# Altium project TTN_Gateway_V2.3.1.PrjPcb (part 1 of 2)
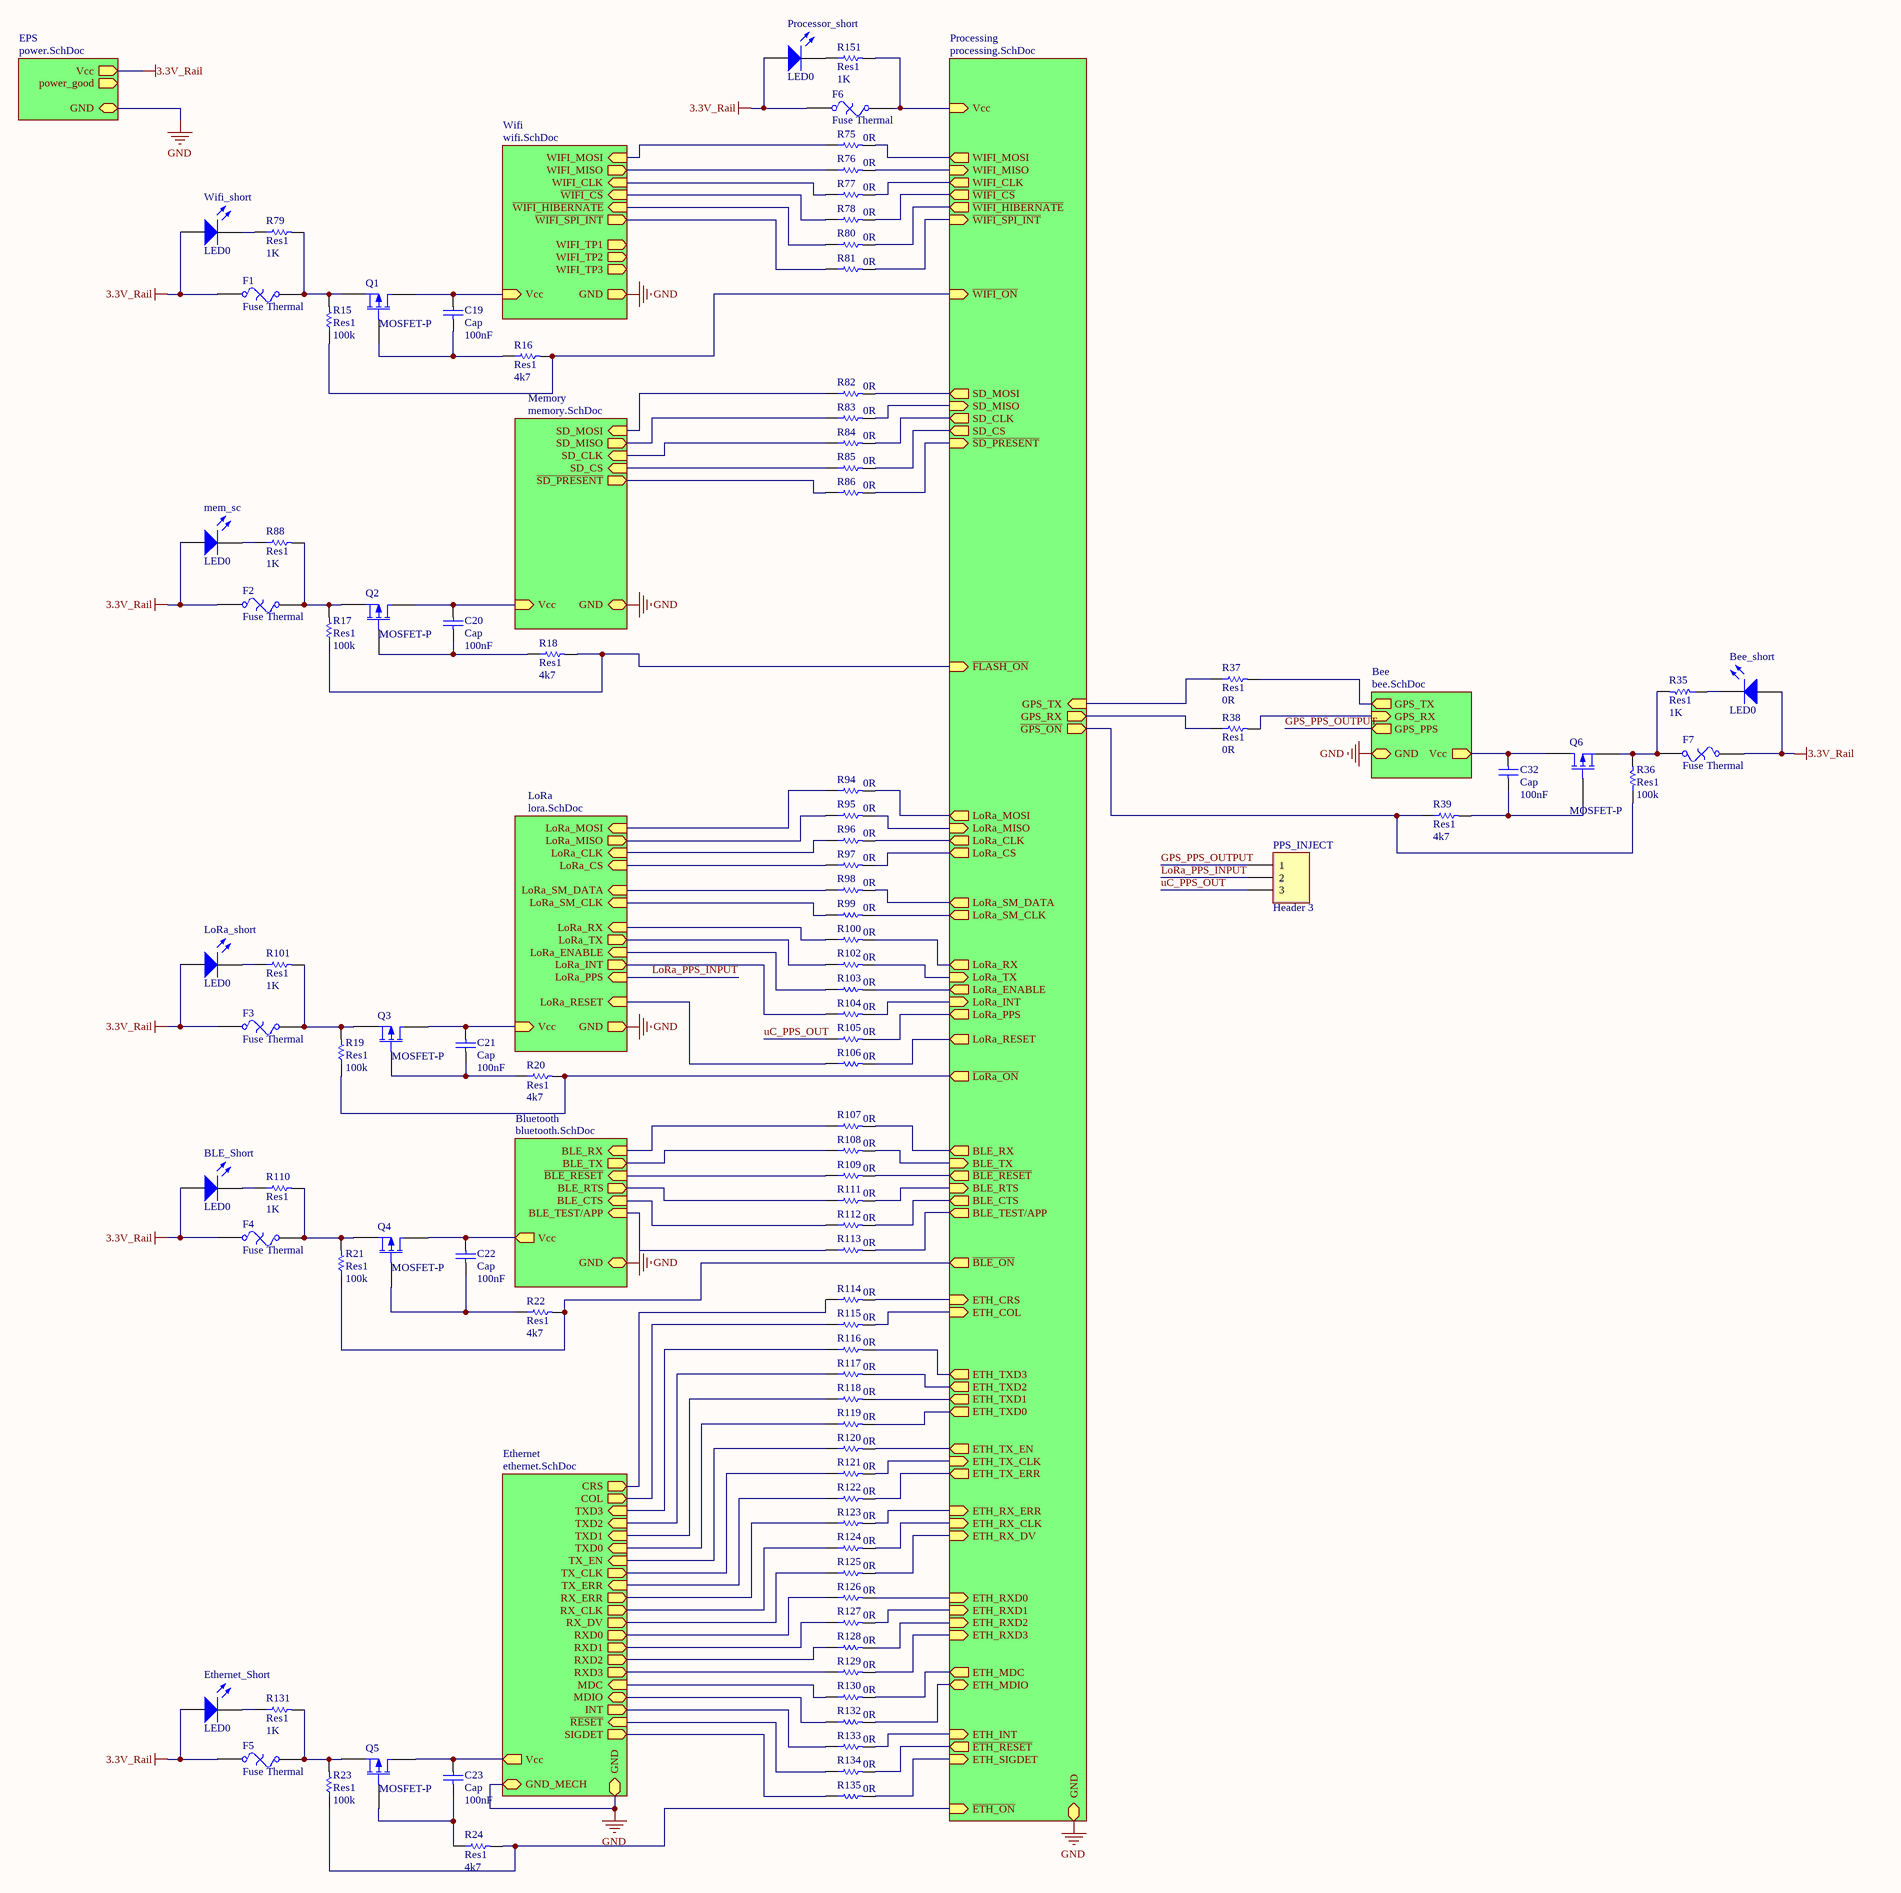
[diagram p0: toplevel.SchDoc]
TWTG_ProjectName: The Things Gateway
9 sheets, 331 parts. Net scope: hierarchical (ports join the sheet entries above them; power ports are global).
Board file: TTN_Gateway_V2.3.1.PcbDoc
Sheets:
  toplevel.SchDoc
    EPS = power.SchDoc
    Wifi = wifi.SchDoc
    Memory = memory.SchDoc
    Ethernet = ethernet.SchDoc
    LoRa = lora.SchDoc
    Bluetooth = bluetooth.SchDoc
    Processing = processing.SchDoc
    Bee = bee.SchDoc

## Sheet toplevel.SchDoc: The Things Gateway Toplevel Overview
size A2; DocumentNumber: 1; SheetNumber: 1; SheetTotal: 9

### Parts
Bee_short  LED0  [C0603]
BLE_Short  LED0  [C0603]
C19  Cap  value 100nF  [6-0805_L]
C20  Cap  value 100nF  [6-0805_L]
C21  Cap  value 100nF  [6-0805_L]
C22  Cap  value 100nF  [6-0805_L]
C23  Cap  value 100nF  [6-0805_L]
C32  Cap  value 100nF  [6-0805_L]
Ethernet_Short  LED0  [C0603]
F1  Fuse Thermal  [1812-polyfuse]
F2  Fuse Thermal  [1812-polyfuse]
F3  Fuse Thermal  [1812-polyfuse]
F4  Fuse Thermal  [1812-polyfuse]
F5  Fuse Thermal  [1812-polyfuse]
F6  Fuse Thermal  [1812-polyfuse]
F7  Fuse Thermal  [1812-polyfuse]
LoRa_short  LED0  [C0603]
mem_sc  LED0  [C0603]
PPS_INJECT  Header 3  [HDR1X3]
Processor_short  LED0  [C0603]
Q1  MOSFET-P  [SOT23_N]
Q2  MOSFET-P  [SOT23_N]
Q3  MOSFET-P  [SOT23_N]
Q4  MOSFET-P  [SOT23_N]
Q5  MOSFET-P  [SOT23_N]
Q6  MOSFET-P  [SOT23_N]
R15  Res1  value 100k  [R0603]
R16  Res1  value 4k7  [R0603]
R17  Res1  value 100k  [R0603]
R18  Res1  value 4k7  [R0603]
R19  Res1  value 100k  [R0603]
R20  Res1  value 4k7  [R0603]
R21  Res1  value 100k  [R0603]
R22  Res1  value 4k7  [R0603]
R23  Res1  value 100k  [R0603]
R24  Res1  value 4k7  [R0603]
R35  Res1  value 1K  [R0603]
R36  Res1  value 100k  [R0603]
R37  Res1  value 0R  [R0603]
R38  Res1  value 0R  [R0603]
R39  Res1  value 4k7  [R0603]
R75  value 0R  [R0603]
R76  value 0R  [R0603]
R77  value 0R  [R0603]
R78  value 0R  [R0603]
R79  Res1  value 1K  [R0603]
R80  value 0R  [R0603]
R81  value 0R  [R0603]
R82  value 0R  [R0603]
R83  value 0R  [R0603]
R84  value 0R  [R0603]
R85  value 0R  [R0603]
R86  value 0R  [R0603]
R88  Res1  value 1K  [R0603]
R94  value 0R  [R0603]
R95  value 0R  [R0603]
R96  value 0R  [R0603]
R97  value 0R  [R0603]
R98  value 0R  [R0603]
R99  value 0R  [R0603]
R100  value 0R  [R0603]
R101  Res1  value 1K  [R0603]
R102  value 0R  [R0603]
R103  value 0R  [R0603]
R104  value 0R  [R0603]
R105  value 0R  [R0603]
R106  value 0R  [R0603]
R107  value 0R  [R0603]
R108  value 0R  [R0603]
R109  value 0R  [R0603]
R110  Res1  value 1K  [R0603]
R111  value 0R  [R0603]
R112  value 0R  [R0603]
R113  value 0R  [R0603]
R114  value 0R  [R0603]
R115  value 0R  [R0603]
R116  value 0R  [R0603]
R117  value 0R  [R0603]
R118  value 0R  [R0603]
R119  value 0R  [R0603]
R120  value 0R  [R0603]
R121  value 0R  [R0603]
R122  value 0R  [R0603]
R123  value 0R  [R0603]
R124  value 0R  [R0603]
R125  value 0R  [R0603]
R126  value 0R  [R0603]
R127  value 0R  [R0603]
R128  value 0R  [R0603]
R129  value 0R  [R0603]
R130  value 0R  [R0603]
R131  Res1  value 1K  [R0603]
R132  value 0R  [R0603]
R133  value 0R  [R0603]
R134  value 0R  [R0603]
R135  value 0R  [R0603]
R151  Res1  value 1K  [R0603]
Wifi_short  LED0  [C0603]

### Sub-sheets
Bee = bee.SchDoc: Vcc (out), GND, GPS_TX (out), GPS_RX (in), GPS_PPS (out)
Bluetooth = bluetooth.SchDoc: Vcc (out), GND (bidir), BLE_RX (in), BLE_TX (out), ~{BLE_RESET} (in), BLE_RTS (out), BLE_CTS (in), BLE_TEST/APP (in)
EPS = power.SchDoc: Vcc (out), GND (bidir), power_good (out)
Ethernet = ethernet.SchDoc: CRS (out), COL (out), TXD3 (in), TXD2 (in), TXD1 (in), TXD0 (in), TX_EN (in), TX_CLK (out), TX_ERR (in), RX_ERR (out), RX_CLK (out), RX_DV (out), RXD0 (out), RXD1 (out), RXD2 (out), RXD3 (out), MDC (in), MDIO, INT (out), ~{RESET} (in), SIGDET (out), Vcc (out), GND (bidir), GND_MECH (bidir)
LoRa = lora.SchDoc: LoRa_MOSI (in), LoRa_MISO (out), LoRa_CLK (in), LoRa_CS (in), LoRa_RX (in), LoRa_TX (out), LoRa_INT (out), LoRa_PPS (in), LoRa_ENABLE (in), LoRa_RESET (in), Vcc (in), GND (out), LoRa_SM_DATA (in), LoRa_SM_CLK (in)
Memory = memory.SchDoc: SD_MOSI (in), SD_MISO (out), SD_CLK (in), SD_CS (in), Vcc (in), GND, ~{SD_PRESENT} (out)
Processing = processing.SchDoc: WIFI_MOSI (out), WIFI_MISO (in), WIFI_CLK (out), ~{WIFI_CS} (out), ~{WIFI_SPI_INT} (in), ~{WIFI_HIBERNATE} (out), SD_MOSI (out), SD_MISO (in), SD_CLK (out), SD_CS (out), ~{SD_PRESENT} (in), LoRa_MOSI (out), LoRa_MISO (in), LoRa_CLK (out), LoRa_CS (out), LoRa_SM_DATA (out), LoRa_SM_CLK (out), LoRa_RX (out), LoRa_TX (in), LoRa_INT (in), LoRa_PPS (out), LoRa_ENABLE (out), LoRa_RESET (out), BLE_RX (out), BLE_TX (in), ~{BLE_RESET} (out), BLE_RTS (in), BLE_CTS (out), BLE_TEST/APP (out), ETH_CRS (in), ETH_COL (in), ETH_TXD3 (out), ETH_TXD2 (out), ETH_TXD1 (out), ETH_TXD0 (out), ETH_TX_EN (out), ETH_TX_CLK (in), ETH_TX_ERR (out), ETH_RX_ERR (in), ETH_RX_CLK (in), ETH_RX_DV (in), ETH_RXD0 (in), ETH_RXD1 (in), ETH_RXD2 (in), ETH_RXD3 (in), ETH_MDC (out), ETH_MDIO, ETH_INT (in), ~{ETH_RESET} (out), ETH_SIGDET (in), Vcc (in), GND (bidir), ~{WIFI_ON} (in), ~{FLASH_ON} (in), ~{LoRa_ON} (out), ~{BLE_ON} (out), ~{ETH_ON} (in), GPS_TX (in), ~{GPS_ON} (out), GPS_RX (out)
Wifi = wifi.SchDoc: Vcc (in), GND (out), WIFI_MOSI (in), WIFI_MISO (out), WIFI_CLK (in), ~{WIFI_CS} (in), WIFI_TP1 (out), WIFI_TP2 (out), WIFI_TP3 (out), ~{WIFI_HIBERNATE} (in), ~{WIFI_SPI_INT} (out)

### Nets
3.3V_Rail: Bee_short.1(A) BLE_Short.1(A) Ethernet_Short.1(A) F1.1 F2.1 F3.1 F4.1 F5.1 F6.1 F7.1 LoRa_short.1(A) mem_sc.1(A) Processor_short.1(A) Wifi_short.1(A) ; sheet EPS/Vcc
ETH_VCC: C23.2 Q5.1(D) ; sheet Ethernet/Vcc
GND: sheet EPS/GND, sheet Wifi/GND, sheet Memory/GND, sheet Ethernet/GND, sheet Ethernet/GND_MECH, sheet LoRa/GND, sheet Bluetooth/GND, sheet Processing/GND, sheet Bee/GND
PROCESSOR_VCC: F6.2 R151.2 ; sheet Processing/Vcc
BLE_CTS: R112.1 ; sheet Bluetooth/BLE_CTS
BLE_RTS: R111.1 ; sheet Bluetooth/BLE_RTS
BLE_RX: R107.1 ; sheet Bluetooth/BLE_RX
BLE_TX: R108.1 ; sheet Bluetooth/BLE_TX
BLE_VCC: C22.2 Q4.1(D) ; sheet Bluetooth/Vcc
GPS_PPS_OUTPUT: PPS_INJECT.1 ; sheet Bee/GPS_PPS
LoRa_PPS_INPUT: PPS_INJECT.2 ; sheet LoRa/LoRa_PPS
MEMORY_VCC: C20.2 Q2.1(D) ; sheet Memory/Vcc
uC_PPS_OUT: PPS_INJECT.3 R105.1
WIFI_VCC: C19.2 Q1.1(D) ; sheet Wifi/Vcc
NetBee_1: C32.2 Q6.1(D) ; sheet Bee/Vcc
NetBee_2: R37.2 ; sheet Bee/GPS_TX
NetBee_3: R38.2 ; sheet Bee/GPS_RX
NetBee_short_2: Bee_short.2(K) R35.1
NetBLE_Short_2: BLE_Short.2(K) R110.1
NetC19_1: C19.1 Q1.2(G) R16.1
NetC20_1: C20.1 Q2.2(G) R18.1
NetC21_1: C21.1 Q3.2(G) R20.1
NetC21_2: C21.2 Q3.1(D) ; sheet LoRa/Vcc
NetC22_1: C22.1 Q4.2(G) R22.1
NetC23_1: C23.1 Q5.2(G) R24.1
NetC32_1: C32.1 Q6.2(G) R39.2
NetD16_3: R134.1 ; sheet Ethernet/~{RESET}
NetEthernet_Short_2: Ethernet_Short.2(K) R131.1
NetF1_2: F1.2 Q1.3(S) R15.2 R79.2
NetF2_2: F2.2 Q2.3(S) R17.2 R88.2
NetF3_2: F3.2 Q3.3(S) R19.2 R101.2
NetF4_2: F4.2 Q4.3(S) R21.2 R110.2
NetF5_2: F5.2 Q5.3(S) R23.2 R131.2
NetF7_2: F7.2 Q6.3(S) R35.2 R36.2
NetLoRa_short_2: LoRa_short.2(K) R101.1
Netmem_sc_2: mem_sc.2(K) R88.1
NetProcessor_short_2: Processor_short.2(K) R151.1
NetR9_1: R78.1 ; sheet Wifi/~{WIFI_CS}
NetR10_1: R80.1 ; sheet Wifi/~{WIFI_HIBERNATE}
NetR11_2: R76.1 ; sheet Wifi/WIFI_MISO
NetR14_2: R86.1 ; sheet Memory/~{SD_PRESENT}
NetR15_1: R15.1 R16.2 ; sheet Processing/~{WIFI_ON}
NetR17_1: R17.1 R18.2 ; sheet Processing/~{FLASH_ON}
NetR19_1: R19.1 R20.2 ; sheet Processing/~{LoRa_ON}
NetR21_1: R21.1 R22.2 ; sheet Processing/~{BLE_ON}
NetR23_1: R23.1 R24.2 ; sheet Processing/~{ETH_ON}
NetR36_1: R36.1 R39.1 ; sheet Processing/~{GPS_ON}
NetR37_1: R37.1 ; sheet Processing/GPS_TX
NetR38_1: R38.1 ; sheet Processing/GPS_RX
NetR40_1: R109.1 ; sheet Bluetooth/~{BLE_RESET}
NetR41_1: R85.1 ; sheet Memory/SD_CS
NetR43_1: R97.1 ; sheet LoRa/LoRa_CS
NetR48_2: R102.1 ; sheet LoRa/LoRa_TX
NetR50_2: R100.1 ; sheet LoRa/LoRa_RX
NetR51_2: R99.2 ; sheet Processing/LoRa_SM_CLK
NetR52_2: R98.2 ; sheet Processing/LoRa_SM_DATA
NetR55_2: R114.1 ; sheet Ethernet/CRS
NetR56_2: R122.1 ; sheet Ethernet/TX_ERR
NetR71_1: R113.1 ; sheet Bluetooth/BLE_TEST/APP
NetR75_1: R75.1 ; sheet Wifi/WIFI_MOSI
NetR75_2: R75.2 ; sheet Processing/WIFI_MOSI
NetR76_2: R76.2 ; sheet Processing/WIFI_MISO
NetR77_1: R77.1 ; sheet Wifi/WIFI_CLK
NetR77_2: R77.2 ; sheet Processing/WIFI_CLK
NetR78_2: R78.2 ; sheet Processing/~{WIFI_CS}
NetR79_1: R79.1 Wifi_short.2(K)
NetR80_2: R80.2 ; sheet Processing/~{WIFI_HIBERNATE}
NetR81_1: R81.1 ; sheet Wifi/~{WIFI_SPI_INT}
NetR81_2: R81.2 ; sheet Processing/~{WIFI_SPI_INT}
NetR82_1: R82.1 ; sheet Memory/SD_MOSI
NetR82_2: R82.2 ; sheet Processing/SD_MOSI
NetR83_1: R83.1 ; sheet Memory/SD_MISO
NetR83_2: R83.2 ; sheet Processing/SD_MISO
NetR84_1: R84.1 ; sheet Memory/SD_CLK
NetR84_2: R84.2 ; sheet Processing/SD_CLK
NetR85_2: R85.2 ; sheet Processing/SD_CS
NetR86_2: R86.2 ; sheet Processing/~{SD_PRESENT}
NetR94_1: R94.1 ; sheet LoRa/LoRa_MOSI
NetR94_2: R94.2 ; sheet Processing/LoRa_MOSI
NetR95_1: R95.1 ; sheet LoRa/LoRa_MISO
NetR95_2: R95.2 ; sheet Processing/LoRa_MISO
NetR96_1: R96.1 ; sheet LoRa/LoRa_CLK
NetR96_2: R96.2 ; sheet Processing/LoRa_CLK
NetR97_2: R97.2 ; sheet Processing/LoRa_CS
NetR98_1: R98.1 ; sheet LoRa/LoRa_SM_DATA
NetR99_1: R99.1 ; sheet LoRa/LoRa_SM_CLK
NetR100_2: R100.2 ; sheet Processing/LoRa_RX
NetR102_2: R102.2 ; sheet Processing/LoRa_TX
NetR103_1: R103.1 ; sheet LoRa/LoRa_ENABLE
NetR103_2: R103.2 ; sheet Processing/LoRa_ENABLE
NetR104_1: R104.1 ; sheet LoRa/LoRa_INT
NetR104_2: R104.2 ; sheet Processing/LoRa_INT
NetR105_2: R105.2 ; sheet Processing/LoRa_PPS
NetR106_1: R106.1 ; sheet LoRa/LoRa_RESET
NetR106_2: R106.2 ; sheet Processing/LoRa_RESET
NetR107_2: R107.2 ; sheet Processing/BLE_RX
NetR108_2: R108.2 ; sheet Processing/BLE_TX
NetR109_2: R109.2 ; sheet Processing/~{BLE_RESET}
NetR111_2: R111.2 ; sheet Processing/BLE_RTS
NetR112_2: R112.2 ; sheet Processing/BLE_CTS
NetR113_2: R113.2 ; sheet Processing/BLE_TEST/APP
NetR114_2: R114.2 ; sheet Processing/ETH_CRS
NetR115_1: R115.1 ; sheet Ethernet/COL
NetR115_2: R115.2 ; sheet Processing/ETH_COL
NetR116_1: R116.1 ; sheet Ethernet/TXD3
NetR116_2: R116.2 ; sheet Processing/ETH_TXD3
NetR117_1: R117.1 ; sheet Ethernet/TXD2
NetR117_2: R117.2 ; sheet Processing/ETH_TXD2
NetR118_1: R118.1 ; sheet Ethernet/TXD1
NetR118_2: R118.2 ; sheet Processing/ETH_TXD1
NetR119_1: R119.1 ; sheet Ethernet/TXD0
NetR119_2: R119.2 ; sheet Processing/ETH_TXD0
NetR120_1: R120.1 ; sheet Ethernet/TX_EN
NetR120_2: R120.2 ; sheet Processing/ETH_TX_EN
NetR121_1: R121.1 ; sheet Ethernet/TX_CLK
NetR121_2: R121.2 ; sheet Processing/ETH_TX_CLK
NetR122_2: R122.2 ; sheet Processing/ETH_TX_ERR
NetR123_1: R123.1 ; sheet Ethernet/RX_ERR
NetR123_2: R123.2 ; sheet Processing/ETH_RX_ERR
NetR124_1: R124.1 ; sheet Ethernet/RX_CLK
NetR124_2: R124.2 ; sheet Processing/ETH_RX_CLK
NetR125_1: R125.1 ; sheet Ethernet/RX_DV
NetR125_2: R125.2 ; sheet Processing/ETH_RX_DV
NetR126_1: R126.1 ; sheet Ethernet/RXD0
NetR126_2: R126.2 ; sheet Processing/ETH_RXD0
NetR127_1: R127.1 ; sheet Ethernet/RXD1
NetR127_2: R127.2 ; sheet Processing/ETH_RXD1
NetR128_1: R128.1 ; sheet Ethernet/RXD2
NetR128_2: R128.2 ; sheet Processing/ETH_RXD2
NetR129_1: R129.1 ; sheet Ethernet/RXD3
NetR129_2: R129.2 ; sheet Processing/ETH_RXD3
NetR130_1: R130.1 ; sheet Ethernet/MDC
NetR130_2: R130.2 ; sheet Processing/ETH_MDC
NetR132_1: R132.1 ; sheet Ethernet/MDIO
NetR132_2: R132.2 ; sheet Processing/ETH_MDIO
NetR133_1: R133.1 ; sheet Ethernet/INT
NetR133_2: R133.2 ; sheet Processing/ETH_INT
NetR134_2: R134.2 ; sheet Processing/~{ETH_RESET}
NetR135_1: R135.1 ; sheet Ethernet/SIGDET
NetR135_2: R135.2 ; sheet Processing/ETH_SIGDET

### Notes on the sheet
- Title
- The Things Products
- Size:
- Date:
- Project:
- A2
- Number:
- Time:
- Revision:
- Sheet
- of
- File:

### Library data of the parts
Bee_short BLE_Short Ethernet_Short LoRa_short mem_sc Processor_short Wifi_short = LED0: Typical INFRARED GaAs LED; Published: 8-Jun-2000; LatestRevisionDate: 08-Jul-2005; LatestRevisionNote: Mech Layer 1 removed.; PackageReference: LED-0; Publisher: Altium Limited; PackageDescription: LED; 2 Leads
C19-C23 C32 = Cap: Capacitor; Published: 8-Jun-2000; LatestRevisionDate: 17-Jul-2002; LatestRevisionNote: Re-released for DXP Platform.; PackageReference: RAD-0.3; Publisher: Altium Limited; PackageDescription: Radial Cap, Thru-Hole; 2 Leads; 0.3 in Pin Spacing
F1-F7 = Fuse Thermal: Thermal Fuse; Published: 24-Mar-1999; LatestRevisionDate: 17-Jul-2002; LatestRevisionNote: Re-released for DXP Platform.; PackageReference: PIN-W2/E2.8; Publisher: Altium Limited; PackageDescription: Thru-Hole; 2 Leads
PPS_INJECT = Header 3: Header, 3-Pin; LatestRevisionDate: 17-Jul-2002; LatestRevisionNote: Re-released for DXP Platform.; Publisher: Altium Limited
Q1-Q6 = MOSFET-P: P-Channel MOSFET; pin to pad: 2>3 3>2; Published: 8-Jun-2000; LatestRevisionDate: 17-Jul-2002; LatestRevisionNote: Re-released for DXP Platform.; PackageVersion: 1995/1996; PackageReference: E3; Publisher: Altium Limited; PackageDescription: TO, Flat Index; 3 In-Line, Axial Leads; Body Dia. 4.6mm; Lead Dia. 0.5 mm (max)
R15-R24 R35-R39 R75-R86 R88 R94-R135 R151 = Res1: Resistor; Published: 8-Jun-2000; LatestRevisionDate: 17-Jul-2002; LatestRevisionNote: Re-released for DXP Platform.; PackageReference: AXIAL-0.3; Publisher: Altium Limited; PackageDescription: Axial Device, Thru-Hole; 2 Leads; 0.3 in Pin Spacing

## Sheet power.SchDoc: Electrical Power System
size A3; Organization: Tweetonig; Address1: Delftsestraat 11; DocumentNumber: 2; Revision: 1.0; SheetNumber: 2; SheetTotal: 9
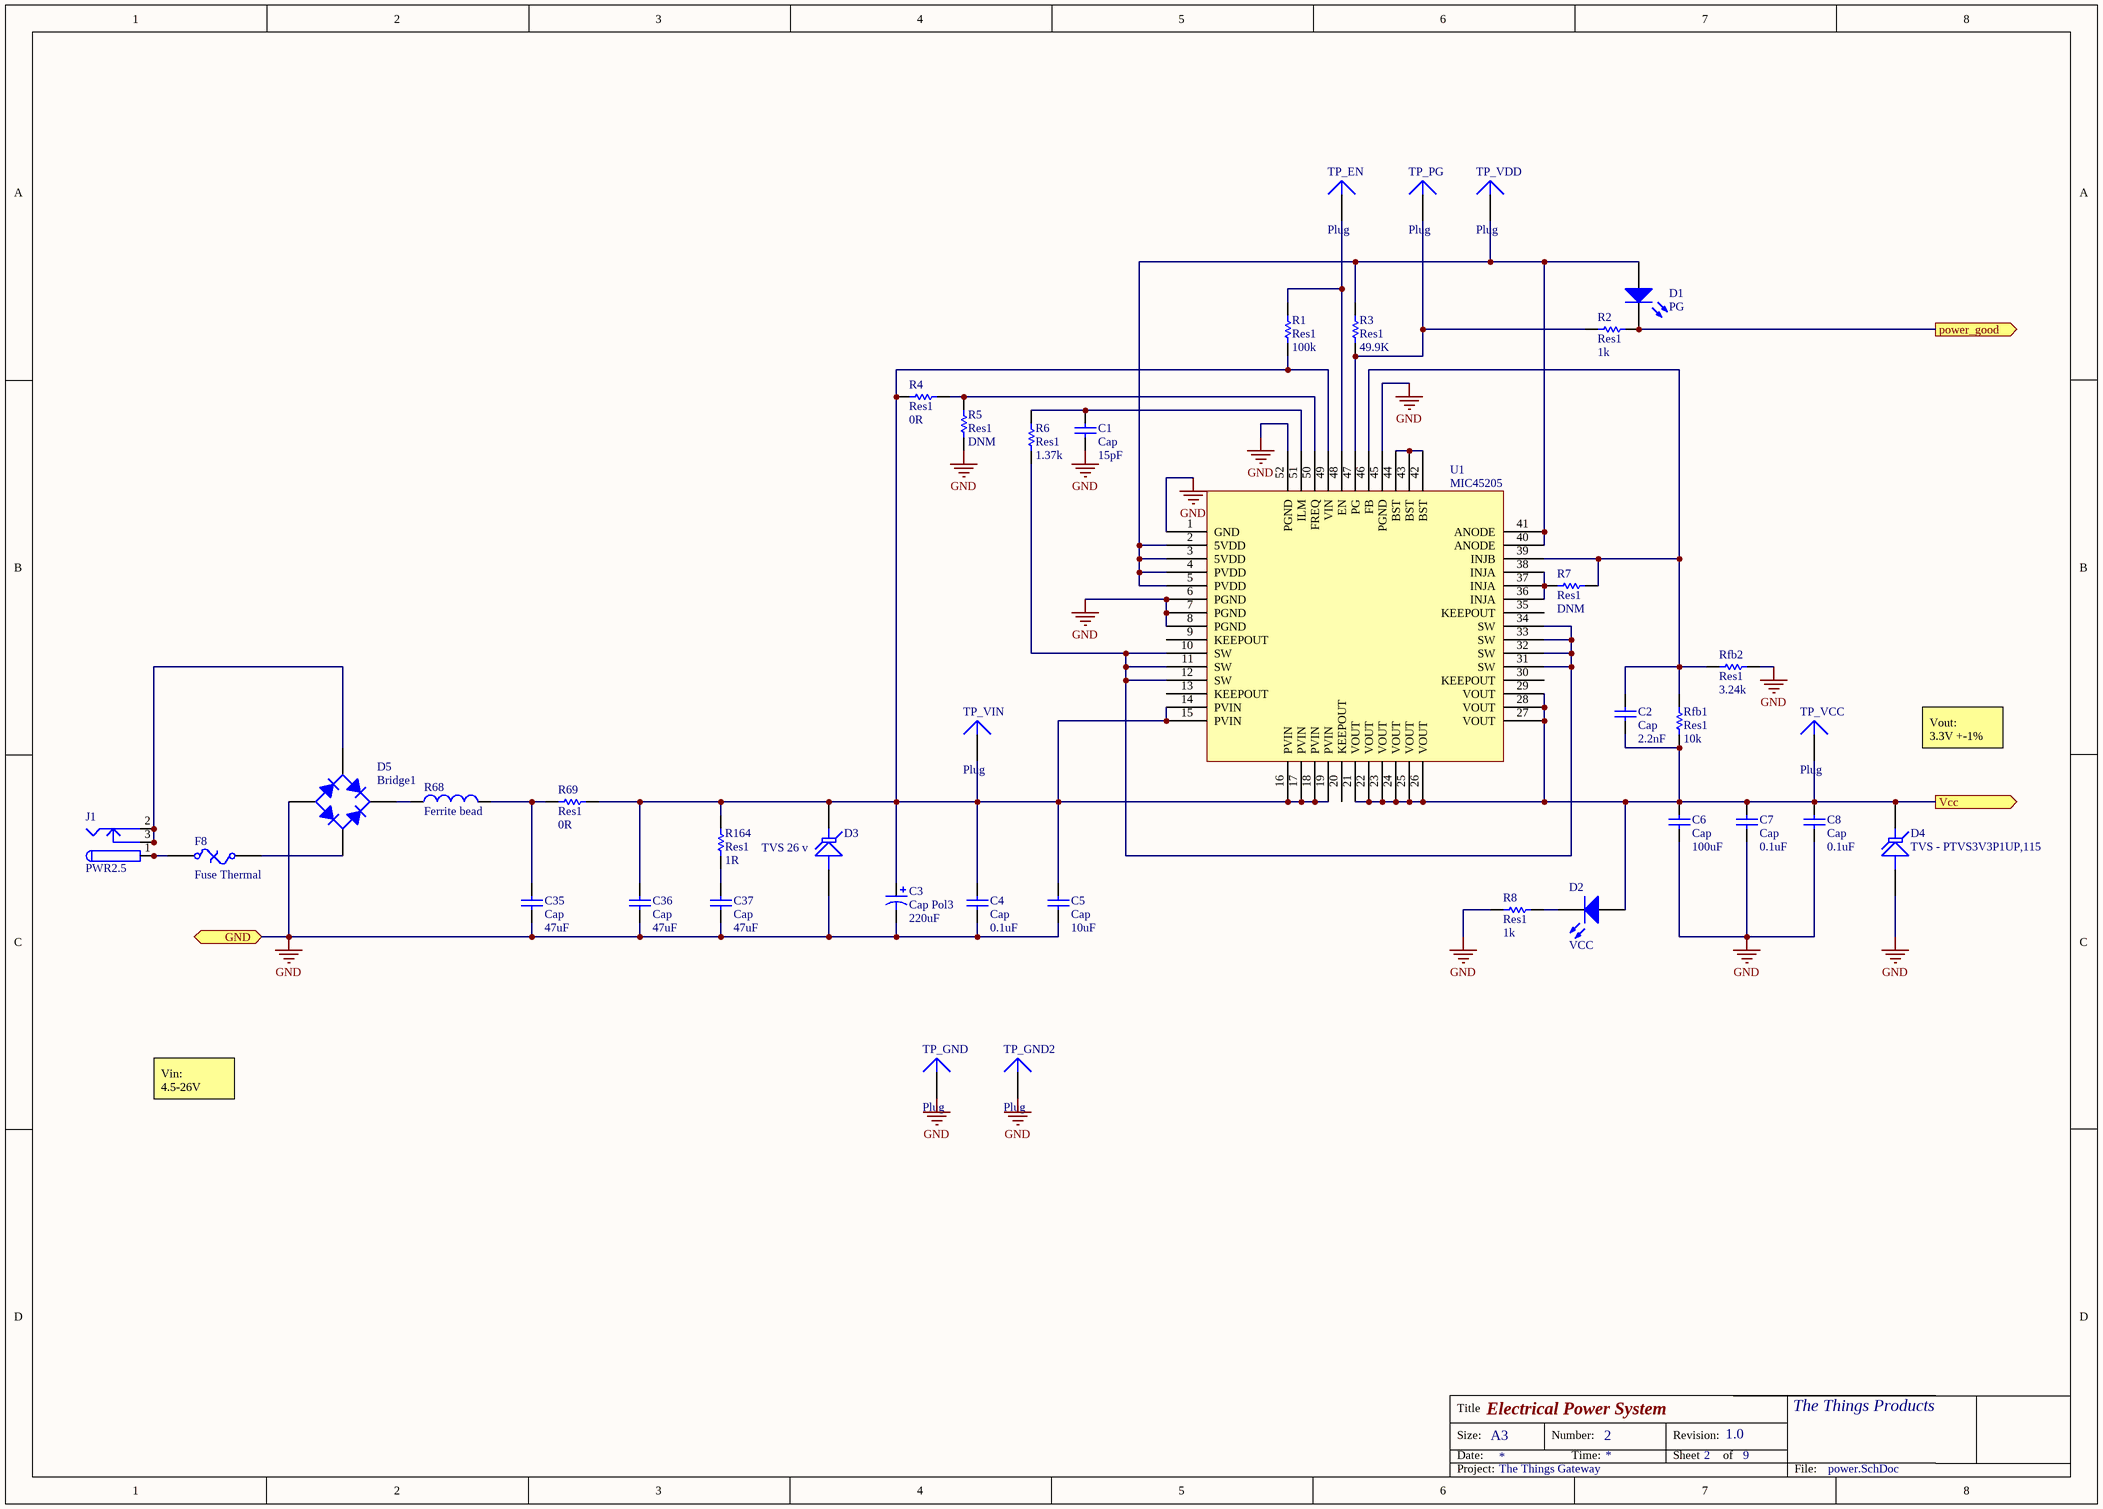
[diagram p1: power.SchDoc]

### Parts
C1  Cap  value 15pF  [C0603]
C2  Cap  value 2.2nF  [C0603]
C3  Cap Pol3  value 220uF  [SMD_CAP_10x7.7mm_220uF - duplicate]
C4  Cap  value 0.1uF  [C1206]
C5  Cap  value 10uF  [C1210]
C6  Cap  value 100uF  [C1210]
C7  Cap  value 0.1uF  [C1206]
C8  Cap  value 0.1uF  [C1206]
C35  Cap  value 47uF  [C1206]
C36  Cap  value 47uF  [C1206]
C37  Cap  value 47uF  [C0603]
D1  PG  [C0603]
D2  VCC  [C0603]
D3  TVS 26 v  [SOD323]
D4  TVS - PTVS3V3P1UP,115  [SOD323]
D5  Bridge1  [4-SDIP]
F8  Fuse Thermal  [1812-polyfuse]
J1  PWR2.5  [KLD-0202]
R1  Res1  value 100k  [R0603]
R2  Res1  value 1k  [R0603]
R3  Res1  value 49.9K  [R0603]
R4  Res1  value 0R  [R0603]
R5  Res1  value DNM  [R0603]
R6  Res1  value 1.37k  [R0603]
R7  Res1  value DNM  [R0603]
R8  Res1  value 1k  [R0603]
R68  Ferrite bead  [R0603]
R69  Res1  value 0R  [R0603]
R164  Res1  value 1R  [R0603]
Rfb1  Res1  value 10k  [R0603]
Rfb2  Res1  value 3.24k  [R0603]
TP_EN  Plug  [PIN1]
TP_GND  Plug  [PIN1]
TP_GND2  Plug  [PIN1]
TP_PG  Plug  [PIN1]
TP_VCC  Plug  [PIN1]
TP_VDD  Plug  [PIN1]
TP_VIN  Plug  [PIN1]
U1  MIC45205  [45205 Thermaly Enhanced]

### Ports
GND (bidir), power_good (out), Vcc (out)

### Nets
3.3V_Rail: C2.1 C6.2 C7.2 C8.2 D2.1(A) D4.2(K) Rfb1.1 TP_VCC.1 U1.21(VOUT) U1.22(VOUT) U1.23(VOUT) U1.24(VOUT) U1.25(VOUT) U1.26(VOUT) U1.27(VOUT) U1.28(VOUT) U1.29(VOUT) ; port Vcc
GND: C1.1 C3.2 C4.1 C5.1 C6.1 C7.1 C8.1 C35.1 C36.1 C37.1 D3.1(A) D4.1(A) D5.2(A) R5.2 R8.1 Rfb2.1 TP_GND.1 TP_GND2.1 U1.1(GND) U1.6(PGND) U1.7(PGND) U1.8(PGND) U1.45(PGND) U1.52(PGND) ; port GND
NetC1_2: C1.2 R6.2 U1.51(ILM)
NetC2_2: C2.2 R7.1 Rfb1.2 Rfb2.2 U1.39(INJB) U1.46(FB)
NetC3_1: C3.1 C4.2 C5.2 C36.2 D3.2(K) R1.1 R4.2 R69.1 R164.1 TP_VIN.1 U1.14(PVIN) U1.15(PVIN) U1.16(PVIN) U1.17(PVIN) U1.18(PVIN) U1.19(PVIN) U1.49(VIN)
NetC35_2: C35.2 R68.2 R69.2
NetC37_2: C37.2 R164.2
NetD1_1: D1.1(A) R3.1 TP_VDD.1 U1.2(5VDD) U1.3(5VDD) U1.4(PVDD) U1.5(PVDD) U1.40(ANODE) U1.41(ANODE)
NetD1_2: D1.2(K) R2.1 ; port power_good
NetD2_2: D2.2(K) R8.2
NetD5_1: D5.1(K) R68.1
NetD5_3: D5.3(C) J1.2 J1.2A J1.2B J1.3 J1.3A J1.3B
NetD5_4: D5.4(C) F8.2
NetF8_1: F8.1 J1.1 J1.1A J1.1B
NetR1_2: R1.2 TP_EN.1 U1.48(EN)
NetR2_2: R2.2 R3.2 TP_PG.1 U1.47(PG)
NetR4_1: R4.1 R5.1 U1.50(FREQ)
NetR6_1: R6.1 U1.10(SW) U1.11(SW) U1.12(SW) U1.31(SW) U1.32(SW) U1.33(SW) U1.34(SW)
NetR7_2: R7.2 U1.36(INJA) U1.37(INJA) U1.38(INJA)
NetU1_42: U1.42(BST) U1.43(BST) U1.44(BST)

Not connected (* = marked no-connect by the designer): U1 9(KEEPOUT) 13(KEEPOUT) 20(KEEPOUT) 30(KEEPOUT) 35(KEEPOUT)

### Notes on the sheet
- Vout:
  3.3V +-1%
- Vin:
  4.5-26V
- Title
- Size:
- Date:
- A3
- Number:
- Time:
- Revision:
- Sheet
- of
- The Things Products
- Project:
- File:

### Library data of the parts
C1 C2 C4-C8 C35-C37 = Cap: Capacitor; Published: 8-Jun-2000; LatestRevisionDate: 17-Jul-2002; LatestRevisionNote: Re-released for DXP Platform.; PackageReference: RAD-0.3; Publisher: Altium Limited; PackageDescription: Radial Cap, Thru-Hole; 2 Leads; 0.3 in Pin Spacing
C3 = Cap Pol3: Polarized Capacitor (Surface Mount); Published: 8-Jun-2000; LatestRevisionDate: 29-May-2009; LatestRevisionNote: IPC-7351 Footprint Added.; PackageReference: C0805; Publisher: Altium Limited; PackageDescription: Chip Capacitor
D1 D2 = LED0: Typical INFRARED GaAs LED; Published: 8-Jun-2000; LatestRevisionDate: 08-Jul-2005; LatestRevisionNote: Mech Layer 1 removed.; PackageReference: LED-0; Publisher: Altium Limited; PackageDescription: LED; 2 Leads
D3 D4 = Tranzorb: Transient Voltage Suppression (TVS) Diode; Published: 24-Mar-1999; LatestRevisionDate: 17-Jul-2002; LatestRevisionNote: Re-released for DXP Platform.; PackageReference: DO-7; Publisher: Altium Limited; PackageDescription: Axial Lead Diode
D5 = Bridge1: Full Wave Diode Bridge; Published: 8-Jun-2000; LatestRevisionDate: 29-May-2009; LatestRevisionNote: Sch pins A & K swapped.; DatasheetVersion: E2732B; PackageReference: D-38; Publisher: Altium Limited; PackageDescription: Bridge Rectifier; 4 Terminals; Body 9.4 x 9.4 mm (typ); Pitch 5.08 mm; Supplier 1: Digi-Key; Supplier Part Number 1: DF04SCT-ND; Supplier 2: Farnell; Supplier Part Number 2: 1467469; Datasheet: https://www.digikey.nl/product-detail/en/fairchild-on-semiconductor/DF04S/DF04SCT-ND/965570
F8 = Fuse Thermal: Thermal Fuse; Published: 24-Mar-1999; LatestRevisionDate: 17-Jul-2002; LatestRevisionNote: Re-released for DXP Platform.; PackageReference: PIN-W2/E2.8; Publisher: Altium Limited; PackageDescription: Thru-Hole; 2 Leads
J1 = PWR2.5: Low Voltage Power Supply Connector; Published: 17-Dec-2003; DatasheetDocument: 09-May-2002; Publisher: Altium Limited; ComponentLink1Description: Manufacturer Link; ComponentLink1URL: http://domino.kycon.com/internet/Products.html
R1-R8 R69 R164 Rfb1 Rfb2 = Res1: Resistor; Published: 8-Jun-2000; LatestRevisionDate: 17-Jul-2002; LatestRevisionNote: Re-released for DXP Platform.; PackageReference: AXIAL-0.3; Publisher: Altium Limited; PackageDescription: Axial Device, Thru-Hole; 2 Leads; 0.3 in Pin Spacing
R68 = Inductor: Code_IEC: 1005; Published: 8-Jun-2000; LatestRevisionDate: 29-May-2009; LatestRevisionNote: IPC-7351 Footprint Added.; PackageReference: 0402-A; Publisher: Altium Limited; PackageDescription: Chip Inductor; Code_JEITA: 0402
U1 = MIC45205: MICREL45205 DC/DC Converter
TP_EN TP_GND TP_GND2 TP_PG TP_VCC TP_VDD TP_VIN = Plug: LatestRevisionDate: 17-Jul-2002; LatestRevisionNote: Re-released for DXP Platform.; Publisher: Altium Limited

## Sheet wifi.SchDoc: Wifi System
size A4; Organization: Tweetonig; Address1: Delftsestraat 11; DocumentNumber: 5; Revision: 1.0; SheetNumber: 5; SheetTotal: 9
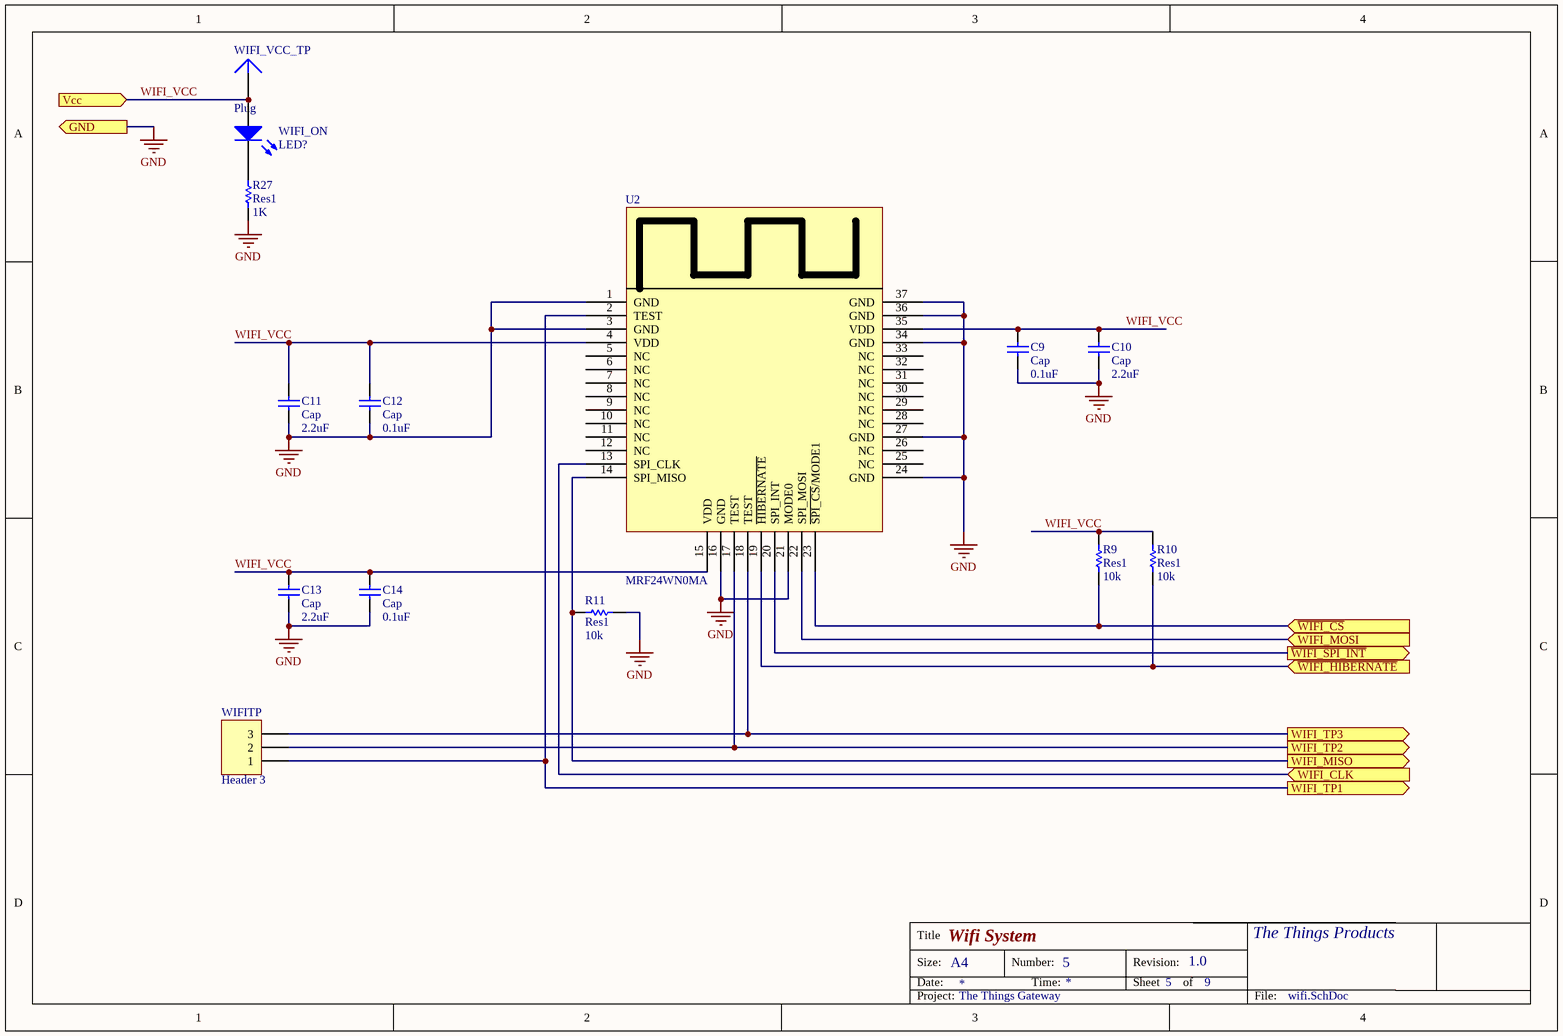
[diagram p2: wifi.SchDoc]

### Parts
C9  Cap  value 0.1uF  [C0603]
C10  Cap  value 2.2uF  [C0603]
C11  Cap  value 2.2uF  [C0603]
C12  Cap  value 0.1uF  [C0603]
C13  Cap  value 2.2uF  [C0603]
C14  Cap  value 0.1uF  [C0603]
R9  Res1  value 10k  [R0603]
R10  Res1  value 10k  [R0603]
R11  Res1  value 10k  [R0603]
R27  Res1  value 1K  [R0603]
U2  MRF24WN0MA  [MRF24WN0MA]
WIFI_ON  LED?  [C0603]
WIFI_VCC_TP  Plug  [PIN1]
WIFITP  Header 3  [HDR1X3]

### Ports
GND (out), Vcc (in), WIFI_CLK (in), WIFI_MISO (out), WIFI_MOSI (in), WIFI_TP1 (out), WIFI_TP2 (out), WIFI_TP3 (out), ~{WIFI_CS} (in), ~{WIFI_HIBERNATE} (in), ~{WIFI_SPI_INT} (out)

### Nets
GND: C9.1 C10.1 C11.1 C12.1 C13.1 C14.1 R11.1 R27.1 U2.1(GND) U2.3(GND) U2.16(GND) U2.21(MODE0) U2.24(GND) U2.27(GND) U2.34(GND) U2.36(GND) U2.37(GND) ; port GND
WIFI_VCC: C9.2 C10.2 C11.2 C12.2 C13.2 C14.2 R9.2 R10.2 U2.4(VDD) U2.15(VDD) U2.35(VDD) WIFI_ON.1(A) WIFI_VCC_TP.1 ; port Vcc
NetR9_1: R9.1 U2.23(~{SPI_CS}/MODE1) ; port ~{WIFI_CS}
NetR10_1: R10.1 U2.19(~{HIBERNATE}) ; port ~{WIFI_HIBERNATE}
NetR11_2: R11.2 U2.14(SPI_MISO) ; port WIFI_MISO
NetR27_2: R27.2 WIFI_ON.2(K)
NetR75_1: U2.22(SPI_MOSI) ; port WIFI_MOSI
NetR77_1: U2.13(SPI_CLK) ; port WIFI_CLK
NetR81_1: U2.20(SPI_INT) ; port ~{WIFI_SPI_INT}
NetU2_2: U2.2(TEST) WIFITP.1 ; port WIFI_TP1
NetU2_17: U2.17(TEST) WIFITP.2 ; port WIFI_TP2
NetU2_18: U2.18(TEST) WIFITP.3 ; port WIFI_TP3

Not connected (* = marked no-connect by the designer): U2 5(NC) 6(NC) 7(NC) 8(NC) 9(NC) 10(NC) 11(NC) 12(NC) 25(NC) 26(NC) 28(NC) 29(NC) 30(NC) 31(NC) 32(NC) 33(NC)

### Notes on the sheet
- Title
- Size:
- Date:
- A4
- Number:
- Time:
- Revision:
- Sheet
- of
- The Things Products
- Project:
- File:

### Library data of the parts
C9-C14 = Cap: Capacitor; Published: 8-Jun-2000; LatestRevisionDate: 17-Jul-2002; LatestRevisionNote: Re-released for DXP Platform.; PackageReference: RAD-0.3; Publisher: Altium Limited; PackageDescription: Radial Cap, Thru-Hole; 2 Leads; 0.3 in Pin Spacing
R9-R11 R27 = Res1: Resistor; Published: 8-Jun-2000; LatestRevisionDate: 17-Jul-2002; LatestRevisionNote: Re-released for DXP Platform.; PackageReference: AXIAL-0.3; Publisher: Altium Limited; PackageDescription: Axial Device, Thru-Hole; 2 Leads; 0.3 in Pin Spacing
U2 = MRF24WN0MA: MRF24WN0MA Wifi SOC
WIFI_ON = LED0: Typical INFRARED GaAs LED; Published: 8-Jun-2000; LatestRevisionDate: 08-Jul-2005; LatestRevisionNote: Mech Layer 1 removed.; PackageReference: LED-0; Publisher: Altium Limited; PackageDescription: LED; 2 Leads
WIFITP = Header 3: Header, 3-Pin; LatestRevisionDate: 17-Jul-2002; LatestRevisionNote: Re-released for DXP Platform.; Publisher: Altium Limited
WIFI_VCC_TP = Plug: LatestRevisionDate: 17-Jul-2002; LatestRevisionNote: Re-released for DXP Platform.; Publisher: Altium Limited

## Sheet memory.SchDoc: Storage system
size A4; Organization: Tweetonig; Address1: Delftsestraat 11; DocumentNumber: 4; Revision: 1.0; SheetNumber: 4; SheetTotal: 9
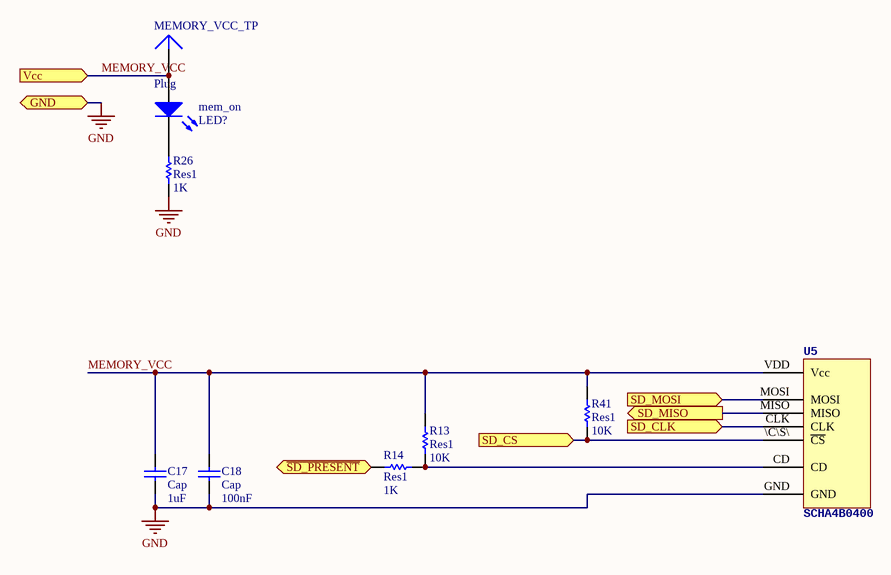
[diagram p3: memory.SchDoc]

### Parts
C17  Cap  value 1uF  [C0603]
C18  Cap  value 100nF  [C0603]
mem_on  LED?  [C0603]
MEMORY_VCC_TP  Plug  [PIN1]
R13  Res1  value 10K  [R0603]
R14  Res1  value 1K  [R0603]
R26  Res1  value 1K  [R0603]
R41  Res1  value 10K  [R0603]
U5  SCHA4B0400  [SCHA4B0400]

### Ports
GND, SD_CLK (in), SD_CS (in), SD_MISO (out), SD_MOSI (in), Vcc (in), ~{SD_PRESENT} (out)

### Nets
GND: C17.1 C18.1 R26.1 U5.GND ; port GND
MEMORY_VCC: C17.2 C18.2 mem_on.1(A) MEMORY_VCC_TP.1 R13.1 R41.2 U5.VDD(Vcc) ; port Vcc
Netmem_on_2: mem_on.2(K) R26.2
NetR13_2: R13.2 R14.1 U5.CD
NetR14_2: R14.2 ; port ~{SD_PRESENT}
NetR41_1: R41.1 U5.\C\S\(~{CS}) ; port SD_CS
NetR82_1: U5.MOSI ; port SD_MOSI
NetR83_1: U5.MISO ; port SD_MISO
NetR84_1: U5.CLK ; port SD_CLK

### Notes on the sheet
- Title
- Size:
- Date:
- A4
- Number:
- Time:
- Revision:
- Sheet
- of
- The Things Products
- Project:
- File:

### Library data of the parts
C17 C18 = Cap: Capacitor; Published: 8-Jun-2000; LatestRevisionDate: 17-Jul-2002; LatestRevisionNote: Re-released for DXP Platform.; PackageReference: RAD-0.3; Publisher: Altium Limited; PackageDescription: Radial Cap, Thru-Hole; 2 Leads; 0.3 in Pin Spacing
mem_on = LED0: Typical INFRARED GaAs LED; Published: 8-Jun-2000; LatestRevisionDate: 08-Jul-2005; LatestRevisionNote: Mech Layer 1 removed.; PackageReference: LED-0; Publisher: Altium Limited; PackageDescription: LED; 2 Leads
R13 R14 R26 R41 = Res1: Resistor; Published: 8-Jun-2000; LatestRevisionDate: 17-Jul-2002; LatestRevisionNote: Re-released for DXP Platform.; PackageReference: AXIAL-0.3; Publisher: Altium Limited; PackageDescription: Axial Device, Thru-Hole; 2 Leads; 0.3 in Pin Spacing
MEMORY_VCC_TP = Plug: LatestRevisionDate: 17-Jul-2002; LatestRevisionNote: Re-released for DXP Platform.; Publisher: Altium Limited

## Sheet ethernet.SchDoc: Ethernet
size A3; Organization: Tweetonig; Address1: Delftsestraat 11; DocumentNumber: 7; Revision: 1.0; SheetNumber: 7; SheetTotal: 9
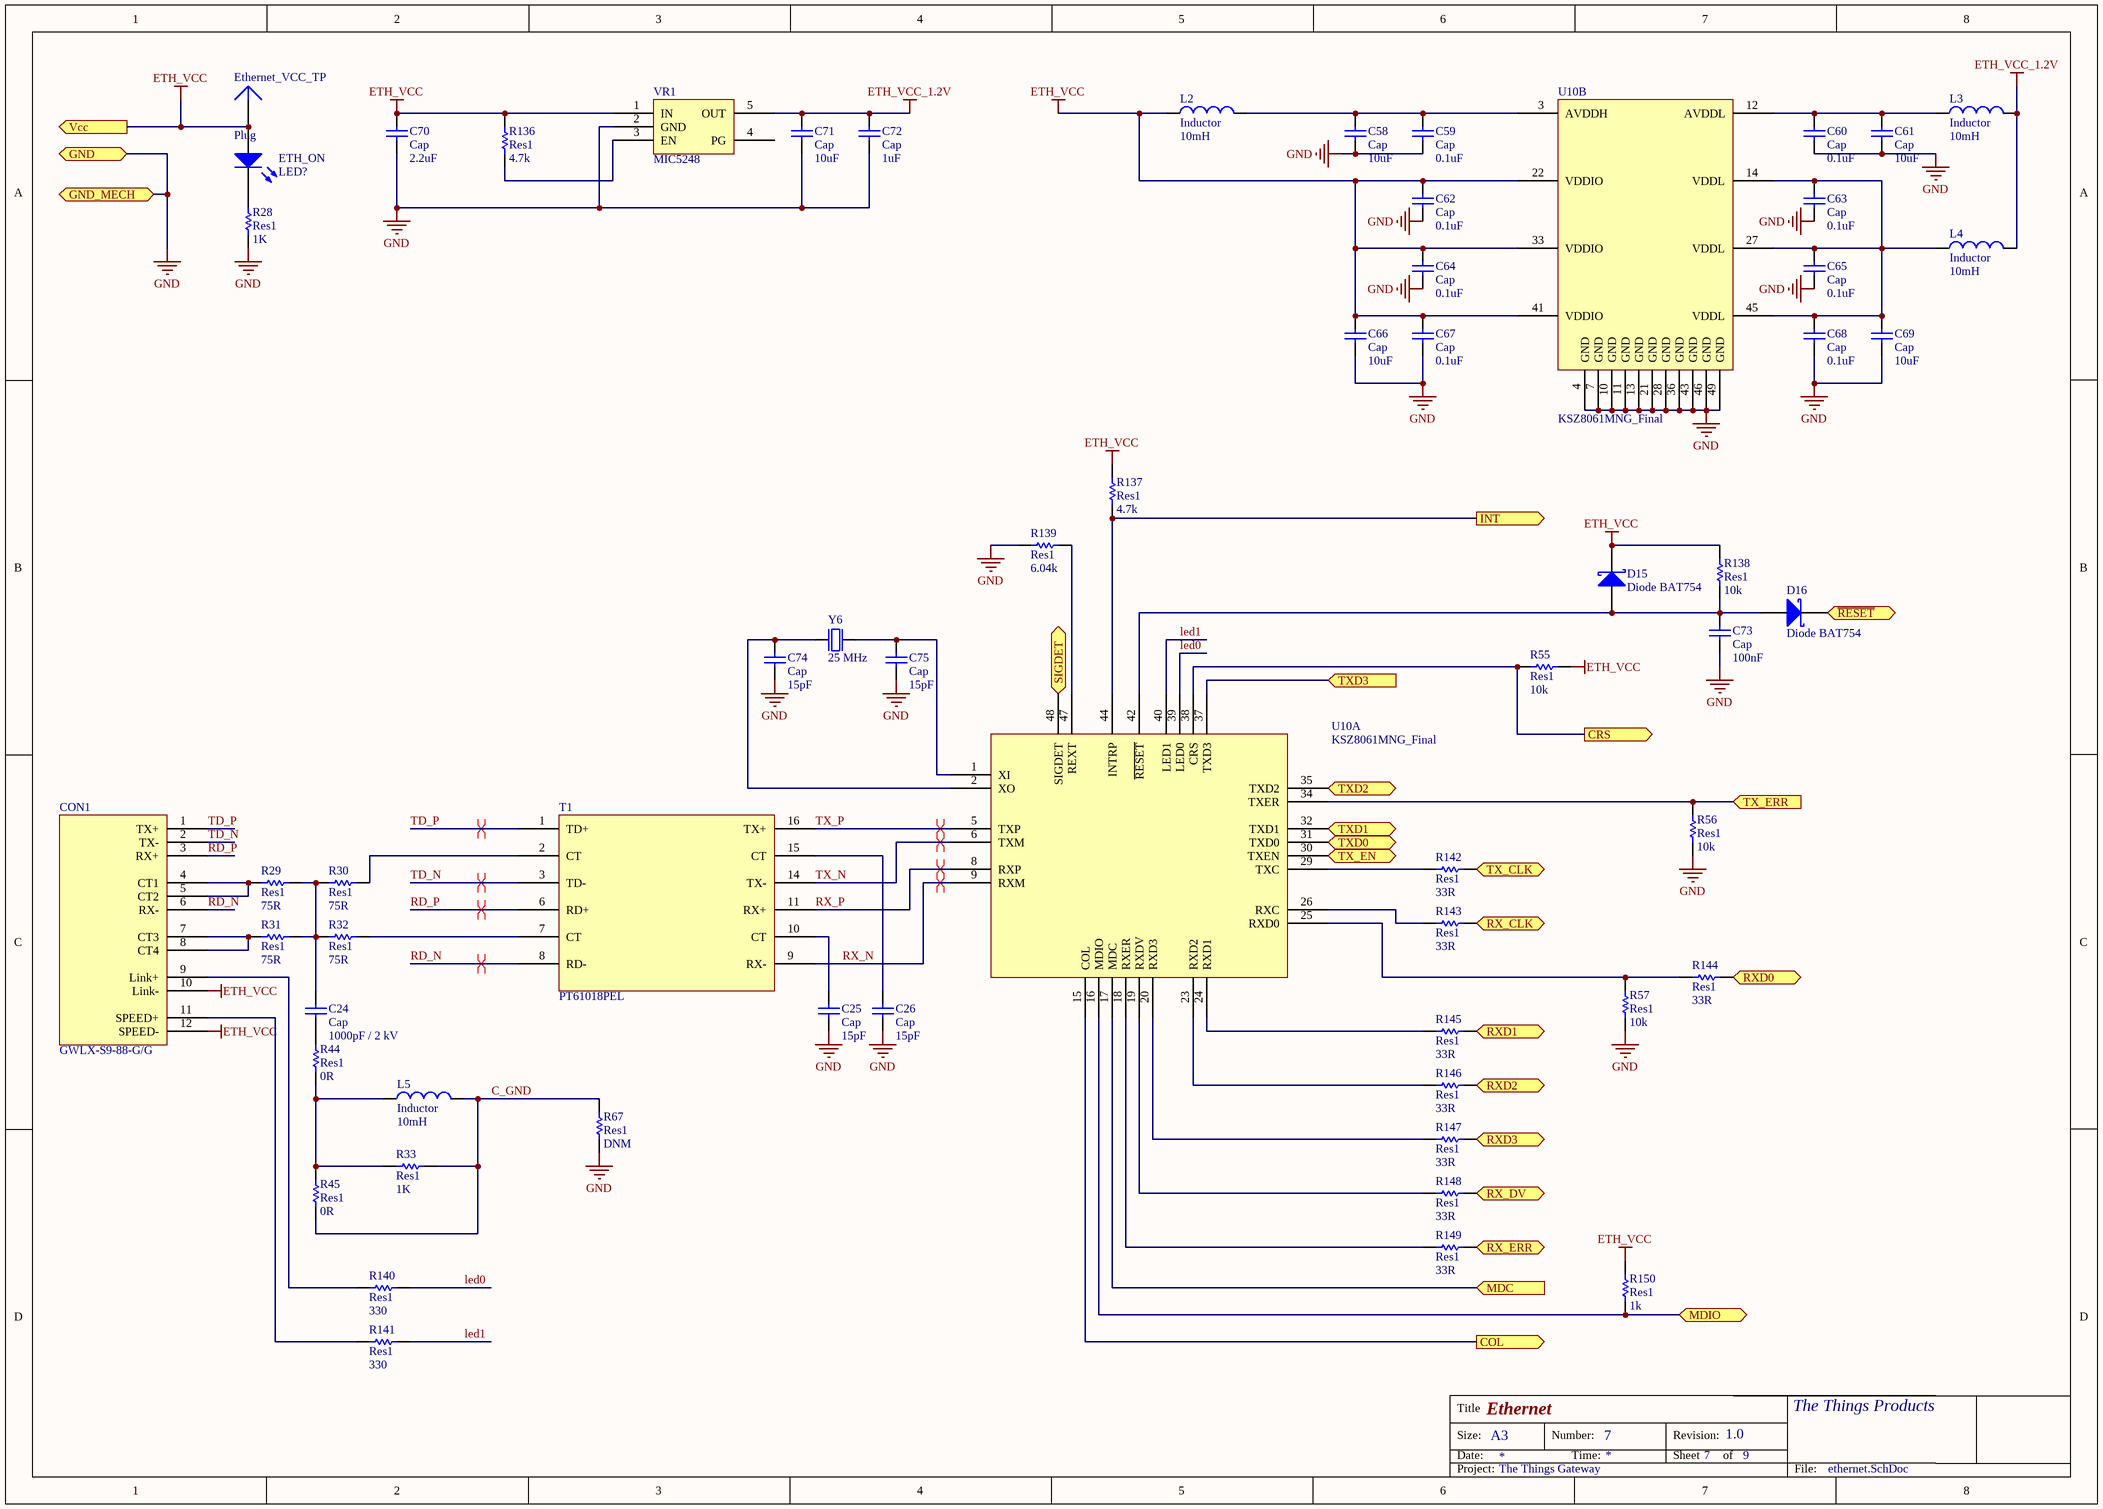
[diagram p4: ethernet.SchDoc]

### Parts
C24  Cap  value 1000pF / 2 kV  [CAP HV 5-7.5mm]
C25  Cap  value 15pF  [C0603]
C26  Cap  value 15pF  [C0603]
C58  Cap  value 10uF  [C0603]
C59  Cap  value 0.1uF  [C0603]
C60  Cap  value 0.1uF  [C0603]
C61  Cap  value 10uF  [C0603]
C62  Cap  value 0.1uF  [C0603]
C63  Cap  value 0.1uF  [C0603]
C64  Cap  value 0.1uF  [C0603]
C65  Cap  value 0.1uF  [C0603]
C66  Cap  value 10uF  [C0603]
C67  Cap  value 0.1uF  [C0603]
C68  Cap  value 0.1uF  [C0603]
C69  Cap  value 10uF  [C0603]
C70  Cap  value 2.2uF  [C0603]
C71  Cap  value 10uF  [C0603]
C72  Cap  value 1uF  [C0603]
C73  Cap  value 100nF  [C0603]
C74  Cap  value 15pF  [C0603]
C75  Cap  value 15pF  [C0603]
CON1  GWLX-S9-88-G/G  [GWLX-S9-88-G/G]
D15  Diode BAT754  [SOT-23_N]
D16  Diode BAT754  [SOT-23_N]
ETH_ON  LED?  [C0603]
Ethernet_VCC_TP  Plug  [PIN1]
L2  Inductor  value 10mH  [6-0805_L]
L3  Inductor  value 10mH  [6-0805_L]
L4  Inductor  value 10mH  [6-0805_L]
L5  Inductor  value 10mH  [6-0805_L]
R28  Res1  value 1K  [R0603]
R29  Res1  value 75R  [R0603]
R30  Res1  value 75R  [R0603]
R31  Res1  value 75R  [R0603]
R32  Res1  value 75R  [R0603]
R33  Res1  value 1K  [R0603]
R44  Res1  value 0R  [R0603]
R45  Res1  value 0R  [R0603]
R55  Res1  value 10k  [R0603]
R56  Res1  value 10k  [R0603]
R57  Res1  value 10k  [R0603]
R67  Res1  value DNM  [R0603]
R136  Res1  value 4.7k  [R0603]
R137  Res1  value 4.7k  [R0603]
R138  Res1  value 10k  [R0603]
R139  Res1  value 6.04k  [R0603]
R140  Res1  value 330  [R0603]
R141  Res1  value 330  [R0603]
R142  Res1  value 33R  [R0603]
R143  Res1  value 33R  [R0603]
R144  Res1  value 33R  [R0603]
R145  Res1  value 33R  [R0603]
R146  Res1  value 33R  [R0603]
R147  Res1  value 33R  [R0603]
R148  Res1  value 33R  [R0603]
R149  Res1  value 33R  [R0603]
R150  Res1  value 1k  [R0603]
T1  PT61018PEL  [WSOIC16_L]
U10  KSZ8061MNG_Final  (parts A,B of 2)
VR1  MIC5248  [SOT23-5_L]
Y6  25 MHz  [Crystal - ABM3B]

### Ports
COL (out), CRS (out), GND (bidir), GND_MECH (bidir), INT (out), MDC (in), MDIO, RX_CLK (out), RX_DV (out), RX_ERR (out), RXD0 (out), RXD1 (out), RXD2 (out), RXD3 (out), SIGDET (out), TX_CLK (out), TX_EN (in), TX_ERR (in), TXD0 (in), TXD1 (in), TXD2 (in), TXD3 (in), Vcc (out), ~{RESET}

### Nets
ETH_VCC: C62.2 C64.2 C66.2 C67.2 C70.2 CON1.10(Link-) CON1.12(SPEED-) D15.3(K) ETH_ON.1(A) Ethernet_VCC_TP.1 L2.1 R55.1 R136.2 R137.2 R138.2 R150.2 U10.22(VDDIO) U10.33(VDDIO) U10.41(VDDIO) VR1.1(IN) ; port Vcc
ETH_VCC_1.2V: C71.2 C72.2 L3.2 L4.2 VR1.5(OUT)
GND: C25.1 C26.1 C58.1 C59.1 C60.1 C61.1 C62.1 C63.1 C64.1 C65.1 C66.1 C67.1 C68.1 C69.1 C70.1 C71.1 C72.1 C73.1 C74.1 C75.1 R28.1 R56.1 R57.1 R67.2 R139.1 U10.4(GND) U10.7(GND) U10.10(GND) U10.11(GND) U10.13(GND) U10.21(GND) U10.28(GND) U10.36(GND) U10.43(GND) U10.46(GND) U10.49(GND) VR1.2(GND) Y6.2(GND) Y6.4(GND) ; port GND, port GND_MECH
C_GND: L5.2 R33.2 R45.2 R67.1
led0: R140.1 U10.39(LED0)
led1: R141.1 U10.40(LED1)
RD_N: CON1.6(RX-) T1.8(RD-)
RD_P: CON1.3(RX+) T1.6(RD+)
RX_N: T1.9(RX-) U10.9(RXM)
RX_P: T1.11(RX+) U10.8(RXP)
TD_N: CON1.2(TX-) T1.3(TD-)
TD_P: CON1.1(TX+) T1.1(TD+)
TX_N: T1.14(TX-) U10.6(TXM)
TX_P: T1.16(TX+) U10.5(TXP)
NetC24_1: C24.1 R44.1
NetC24_2: C24.2 R29.2 R30.1 R31.2 R32.1
NetC25_2: C25.2 T1.10(CT)
NetC26_2: C26.2 T1.15(CT)
NetC58_2: C58.2 C59.2 L2.2 U10.3(AVDDH)
NetC60_2: C60.2 C61.2 L3.1 U10.12(AVDDL)
NetC63_2: C63.2 C65.2 C68.2 C69.2 L4.1 U10.14(VDDL) U10.27(VDDL) U10.45(VDDL)
NetC73_2: C73.2 D15.1(A) D16.1(A) R138.1 U10.42(~{RESET})
NetC74_2: C74.2 U10.2(XO) Y6.1(inp)
NetC75_2: C75.2 U10.1(XI) Y6.3(out)
NetCON1_4: CON1.4(CT1) CON1.5(CT2) R29.1
NetCON1_7: CON1.7(CT3) CON1.8(CT4) R31.1
NetCON1_9: CON1.9(Link+) R140.2
NetCON1_11: CON1.11(SPEED+) R141.2
NetD16_3: D16.3(K) ; port ~{RESET}
NetETH_ON_2: ETH_ON.2(K) R28.2
NetL5_1: L5.1 R33.1 R44.2 R45.1
NetR30_2: R30.2 T1.2(CT)
NetR32_2: R32.2 T1.7(CT)
NetR55_2: R55.2 U10.38(CRS) ; port CRS
NetR56_2: R56.2 U10.34(TXER) ; port TX_ERR
NetR57_2: R57.2 R144.2 U10.25(RXD0)
NetR115_1: U10.15(COL) ; port COL
NetR116_1: U10.37(TXD3) ; port TXD3
NetR117_1: U10.35(TXD2) ; port TXD2
NetR118_1: U10.32(TXD1) ; port TXD1
NetR119_1: U10.31(TXD0) ; port TXD0
NetR120_1: U10.30(TXEN) ; port TX_EN
NetR121_1: R142.1 ; port TX_CLK
NetR123_1: R149.1 ; port RX_ERR
NetR124_1: R143.1 ; port RX_CLK
NetR125_1: R148.1 ; port RX_DV
NetR126_1: R144.1 ; port RXD0
NetR127_1: R145.1 ; port RXD1
NetR128_1: R146.1 ; port RXD2
NetR129_1: R147.1 ; port RXD3
NetR130_1: U10.17(MDC) ; port MDC
NetR132_1: R150.1 U10.16(MDIO) ; port MDIO
NetR133_1: R137.1 U10.44(INTRP) ; port INT
NetR135_1: U10.48(SIGDET) ; port SIGDET
NetR136_1: R136.1 VR1.3(EN)
NetR139_2: R139.2 U10.47(REXT)
NetR142_2: R142.2 U10.29(TXC)
NetR143_2: R143.2 U10.26(RXC)
NetR145_2: R145.2 U10.24(RXD1)
NetR146_2: R146.2 U10.23(RXD2)
NetR147_2: R147.2 U10.20(RXD3)
NetR148_2: R148.2 U10.19(RXDV)
NetR149_2: R149.2 U10.18(RXER)

Not connected (* = marked no-connect by the designer): VR1 4(PG)

### Layout directives
differential pair: RD_N, RD_P, RX_N, RX_P, TD_N, TD_P, TX_N, TX_P

### Notes on the sheet
- Title
- Size:
- Date:
- A3
- Number:
- Time:
- Revision:
- Sheet
- of
- The Things Products
- Project:
- File:

### Library data of the parts
C24-C26 C58-C75 = Cap: Capacitor; Published: 8-Jun-2000; LatestRevisionDate: 17-Jul-2002; LatestRevisionNote: Re-released for DXP Platform.; PackageReference: RAD-0.3; Publisher: Altium Limited; PackageDescription: Radial Cap, Thru-Hole; 2 Leads; 0.3 in Pin Spacing
CON1 = GWLX-S9-88-G/G: GWLX-S9-88-G/G Ethernet Jack w/Leds
D15 D16 = Diode BAT17: Silicon RF Schottky Diode for Mixer Applications in the VHF/UHF Range; Note: Pin 2 is not connected and not drawn.; Published: 21-Mar-2003; LatestRevisionDate: 29-May-2009; LatestRevisionNote: IPC-7351 Footprint Added.; DatasheetVersion: Oct-1999; PackageVersion: Sep-2001; PackageReference: SOT-23; Publisher: Altium Limited; PackageDescription: 3-Pin SOT-23 Package 0.95 mm Pitch, 2.5 mm Lead Span; ComponentLink1Description: Manufacturer Link; ComponentLink1URL: http://www.infineon.com/; ComponentLink2Description: Datasheet; ComponentLink2URL: http://www.infineon.com/upload/Document/cmc_upload/documents/009/363/bat17series.pdf
ETH_ON = LED0: Typical INFRARED GaAs LED; Published: 8-Jun-2000; LatestRevisionDate: 08-Jul-2005; LatestRevisionNote: Mech Layer 1 removed.; PackageReference: LED-0; Publisher: Altium Limited; PackageDescription: LED; 2 Leads
L2-L5 = Inductor: Code_IEC: 1005; Published: 8-Jun-2000; LatestRevisionDate: 29-May-2009; LatestRevisionNote: IPC-7351 Footprint Added.; PackageReference: 0402-A; Publisher: Altium Limited; PackageDescription: Chip Inductor; Code_JEITA: 0402
R28-R33 R44 R45 R55-R57 R67 R136-R150 = Res1: Resistor; Published: 8-Jun-2000; LatestRevisionDate: 17-Jul-2002; LatestRevisionNote: Re-released for DXP Platform.; PackageReference: AXIAL-0.3; Publisher: Altium Limited; PackageDescription: Axial Device, Thru-Hole; 2 Leads; 0.3 in Pin Spacing
T1 = PT61018PEL: PT61018PEL - Ethernet Transformer
U10 = KSZ8061MNG_Final: Micrel KSZ8061MNG PHY-Ethernet Tranceiver
VR1 = MIC5248-x.xYM5: Microchip MIC5248 Regulator
Y6 = NX2520SA-16MHZ-STD-CSW-5: XTAL SMD 2520, 16MHz, 8pF, ±15ppm; Manufacturer: NDK; Note: XTAL SMD 16.000MHz; Artikkelnr Noca: 22019192; Artikkelnr Simpro: N.A.; Part Number: NX2520SA-16MHZ-STD-CSW-5; Manufacturer Part Number: NX2520SA-16MHZ-STD-CSW-5; Datasheet: http://www.ndk.com/images/products/catalog/c_NX2520SA-STD-CSW-5_e.pdf; LatestRevisionDate: 2012-06-15; Pin Count: 4; Publisher: Nordic Semiconductor; Published: 2012-06-15; Value: 16MHz; Supplier: Digi-Key; Supplier part number: 644-1169-1-ND; 2nd source Supplier: *; 2nd source part number: *; Footprint Doc: BT-XTAL_2520
Ethernet_VCC_TP = Plug: LatestRevisionDate: 17-Jul-2002; LatestRevisionNote: Re-released for DXP Platform.; Publisher: Altium Limited

## Sheet lora.SchDoc: LoRa Modem
size A4; Organization: Tweetonig; Address1: Delftsestraat 11; DocumentNumber: 8; Revision: 1.0; SheetNumber: 8; SheetTotal: 9
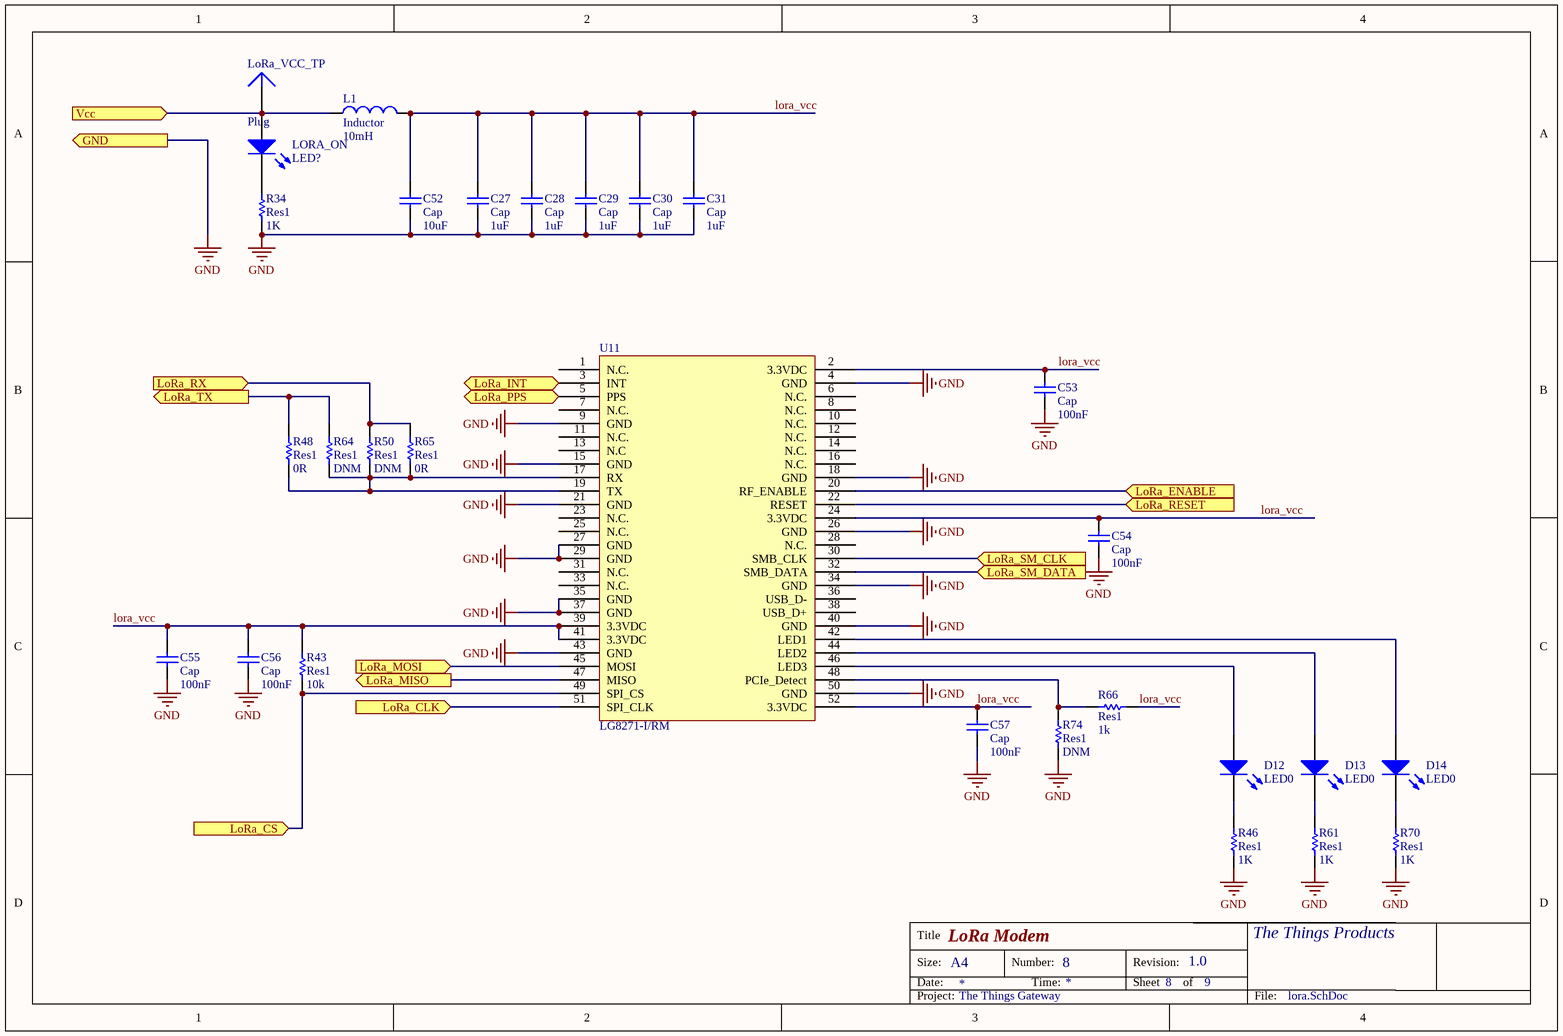
[diagram p5: lora.SchDoc]

### Parts
C27  Cap  value 1uF  [C1206]
C28  Cap  value 1uF  [C1206]
C29  Cap  value 1uF  [C1206]
C30  Cap  value 1uF  [C1206]
C31  Cap  value 1uF  [C1206]
C52  Cap  value 10uF  [C1206]
C53  Cap  value 100nF  [C0603]
C54  Cap  value 100nF  [C0603]
C55  Cap  value 100nF  [C0603]
C56  Cap  value 100nF  [C0603]
C57  Cap  value 100nF  [C0603]
D12  LED0  [C0603]
D13  LED0  [C0603]
D14  LED0  [C0603]
L1  Inductor  value 10mH  [2029]
LORA_ON  LED?  [C0603]
LoRa_VCC_TP  Plug  [PIN1]
R34  Res1  value 1K  [R0603]
R43  Res1  value 10k  [R0603]
R46  Res1  value 1K  [R0603]
R48  Res1  value 0R  [R0603]
R50  Res1  value DNM  [R0603]
R61  Res1  value 1K  [R0603]
R64  Res1  value DNM  [R0603]
R65  Res1  value 0R  [R0603]
R66  Res1  value 1k  [R0603]
R70  Res1  value 1K  [R0603]
R74  Res1  value DNM  [R0603]
U11  LG8271-I/RM  [BTB-SM0-8-2H52F]

### Ports
GND (out), LoRa_CLK (in), LoRa_CS (in), LoRa_ENABLE (in), LoRa_INT (out), LoRa_MISO (out), LoRa_MOSI (in), LoRa_PPS (in), LoRa_RESET (in), LoRa_RX (in), LoRa_SM_CLK (in), LoRa_SM_DATA (in), LoRa_TX (out), Vcc (in)

### Nets
GND: C27.1 C28.1 C29.1 C30.1 C31.1 C52.1 C53.1 C54.1 C55.1 C56.1 C57.1 R34.1 R46.1 R61.1 R70.1 R74.1 U11.4(GND) U11.9(GND) U11.15(GND) U11.18(GND) U11.21(GND) U11.26(GND) U11.27(GND) U11.29(GND) U11.34(GND) U11.35(GND) U11.37(GND) U11.40(GND) U11.43(GND) U11.50(GND) ; port GND
LoRa_PPS_INPUT: U11.5(PPS) ; port LoRa_PPS
lora_vcc: C27.2 C28.2 C29.2 C30.2 C31.2 C52.2 C53.2 C54.2 C55.2 C56.2 C57.2 L1.2 R43.2 R66.1 U11.2(3.3VDC) U11.24(3.3VDC) U11.39(3.3VDC) U11.41(3.3VDC) U11.52(3.3VDC)
NetC21_2: L1.1 LORA_ON.1(A) LoRa_VCC_TP.1 ; port Vcc
NetD12_1: D12.1(A) U11.46(LED3)
NetD12_2: D12.2(K) R46.2
NetD13_1: D13.1(A) U11.44(LED2)
NetD13_2: D13.2(K) R61.2
NetD14_1: D14.1(A) U11.42(LED1)
NetD14_2: D14.2(K) R70.2
NetLORA_ON_2: LORA_ON.2(K) R34.2
NetR43_1: R43.1 U11.49(SPI_CS) ; port LoRa_CS
NetR48_1: R48.1 R50.1 R64.1 R65.2 U11.17(RX) U11.19(TX)
NetR48_2: R48.2 R64.2 ; port LoRa_TX
NetR50_2: R50.2 R65.1 ; port LoRa_RX
NetR66_2: R66.2 R74.2 U11.48(PCIe_Detect)
NetR94_1: U11.45(MOSI) ; port LoRa_MOSI
NetR95_1: U11.47(MISO) ; port LoRa_MISO
NetR96_1: U11.51(SPI_CLK) ; port LoRa_CLK
NetR98_1: U11.32(SMB_DATA) ; port LoRa_SM_DATA
NetR99_1: U11.30(SMB_CLK) ; port LoRa_SM_CLK
NetR103_1: U11.20(RF_ENABLE) ; port LoRa_ENABLE
NetR104_1: U11.3(INT) ; port LoRa_INT
NetR106_1: U11.22(RESET) ; port LoRa_RESET

Not connected (* = marked no-connect by the designer): U11 1(N.C.) 6(N.C.) 7(N.C.) 8(N.C.) 10(N.C.) 11(N.C.) 12(N.C.) 13(N.C) 14(N.C.) 16(N.C.) 23(N.C.) 25(N.C.) 28(N.C.) 31(N.C.) 33(N.C.) 36(USB_D-) 38(USB_D+)

### Notes on the sheet
- Title
- Size:
- Date:
- A4
- Number:
- Time:
- Revision:
- Sheet
- of
- The Things Products
- Project:
- File:

### Library data of the parts
C27-C31 C52-C57 = Cap: Capacitor; Published: 8-Jun-2000; LatestRevisionDate: 17-Jul-2002; LatestRevisionNote: Re-released for DXP Platform.; PackageReference: RAD-0.3; Publisher: Altium Limited; PackageDescription: Radial Cap, Thru-Hole; 2 Leads; 0.3 in Pin Spacing
D12-D14 LORA_ON = LED0: Typical INFRARED GaAs LED; Published: 8-Jun-2000; LatestRevisionDate: 08-Jul-2005; LatestRevisionNote: Mech Layer 1 removed.; PackageReference: LED-0; Publisher: Altium Limited; PackageDescription: LED; 2 Leads
L1 = Inductor: Code_IEC: 1005; Published: 8-Jun-2000; LatestRevisionDate: 29-May-2009; LatestRevisionNote: IPC-7351 Footprint Added.; PackageReference: 0402-A; Publisher: Altium Limited; PackageDescription: Chip Inductor; Code_JEITA: 0402
R34 R43 R46 R48 R50 R61 R64-R66 R70 R74 = Res1: Resistor; Published: 8-Jun-2000; LatestRevisionDate: 17-Jul-2002; LatestRevisionNote: Re-released for DXP Platform.; PackageReference: AXIAL-0.3; Publisher: Altium Limited; PackageDescription: Axial Device, Thru-Hole; 2 Leads; 0.3 in Pin Spacing
U11 = MCP LoRa Gateway: Microchip Mini PCI Express LoRa Radio
LoRa_VCC_TP = Plug: LatestRevisionDate: 17-Jul-2002; LatestRevisionNote: Re-released for DXP Platform.; Publisher: Altium Limited

## Sheet bluetooth.SchDoc: TTN Gateway Bluetooth System
size A4; Author: S. Haitjema; CompanyName: Tweetonig; Address1: Delftsestraat 11; Address2: Rotterdam; DocumentNumber: 3; Revision: 1; SheetNumber: 3; SheetTotal: 9
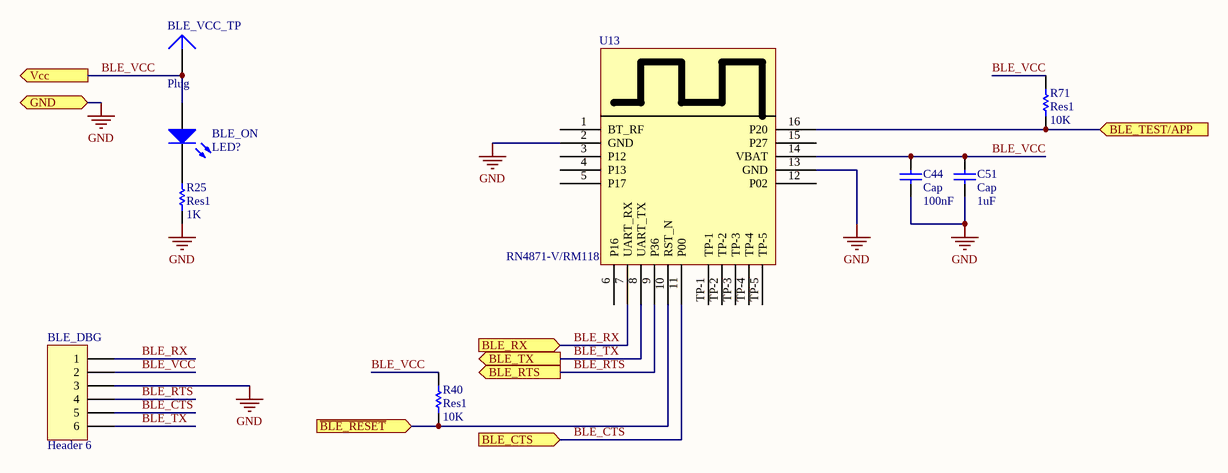
[diagram p6: bluetooth.SchDoc]

### Parts
BLE_DBG  Header 6  [HDR1X6]
BLE_ON  LED?  [C0603]
BLE_VCC_TP  Plug  [PIN1]
C44  Cap  value 100nF  [C0603]
C51  Cap  value 1uF  [C0603]
R25  Res1  value 1K  [R0603]
R40  Res1  value 10K  [R0603]
R71  Res1  value 10K  [R0603]
U13  RN4871-V/RM118  [BM71BLES1FC2]

### Ports
BLE_CTS (in), BLE_RTS (out), BLE_RX (in), BLE_TEST/APP (in), BLE_TX (out), GND (bidir), Vcc (out), ~{BLE_RESET} (in)

### Nets
GND: BLE_DBG.3 C44.1 C51.1 R25.1 U13.2(GND) U13.13(GND) ; port GND
BLE_CTS: BLE_DBG.5 U13.11(P00) ; port BLE_CTS
BLE_RTS: BLE_DBG.4 U13.9(P36) ; port BLE_RTS
BLE_RX: BLE_DBG.1 U13.7(UART_RX) ; port BLE_RX
BLE_TX: BLE_DBG.6 U13.8(UART_TX) ; port BLE_TX
BLE_VCC: BLE_DBG.2 BLE_ON.1(A) BLE_VCC_TP.1 C44.2 C51.2 R40.2 R71.2 U13.14(VBAT) ; port Vcc
NetBLE_ON_2: BLE_ON.2(K) R25.2
NetR40_1: R40.1 U13.10(RST_N) ; port ~{BLE_RESET}
NetR71_1: R71.1 U13.16(P20) ; port BLE_TEST/APP

Not connected (* = marked no-connect by the designer): U13 1(BT_RF) 3(P12) 4(P13) 5(P17) 6(P16) 12(P02) 15(P27) TP-1 TP-2 TP-3 TP-4 TP-5

### Notes on the sheet
- Title
- Size:
- Date:
- A4
- Number:
- Time:
- Revision:
- Sheet
- of
- The Things Products
- Project:
- File:

### Library data of the parts
BLE_DBG = Header 6: Header, 6-Pin; LatestRevisionDate: 17-Jul-2002; LatestRevisionNote: Re-released for DXP Platform.; Publisher: Altium Limited
BLE_ON = LED0: Typical INFRARED GaAs LED; Published: 8-Jun-2000; LatestRevisionDate: 08-Jul-2005; LatestRevisionNote: Mech Layer 1 removed.; PackageReference: LED-0; Publisher: Altium Limited; PackageDescription: LED; 2 Leads
C44 C51 = Cap: Capacitor; Published: 8-Jun-2000; LatestRevisionDate: 17-Jul-2002; LatestRevisionNote: Re-released for DXP Platform.; PackageReference: RAD-0.3; Publisher: Altium Limited; PackageDescription: Radial Cap, Thru-Hole; 2 Leads; 0.3 in Pin Spacing
R25 R40 R71 = Res1: Resistor; Published: 8-Jun-2000; LatestRevisionDate: 17-Jul-2002; LatestRevisionNote: Re-released for DXP Platform.; PackageReference: AXIAL-0.3; Publisher: Altium Limited; PackageDescription: Axial Device, Thru-Hole; 2 Leads; 0.3 in Pin Spacing
U13 = BM718LES1FC2: RN4871-V/RM118 Bluetooth 4.2 LE Mesh
BLE_VCC_TP = Plug: LatestRevisionDate: 17-Jul-2002; LatestRevisionNote: Re-released for DXP Platform.; Publisher: Altium Limited